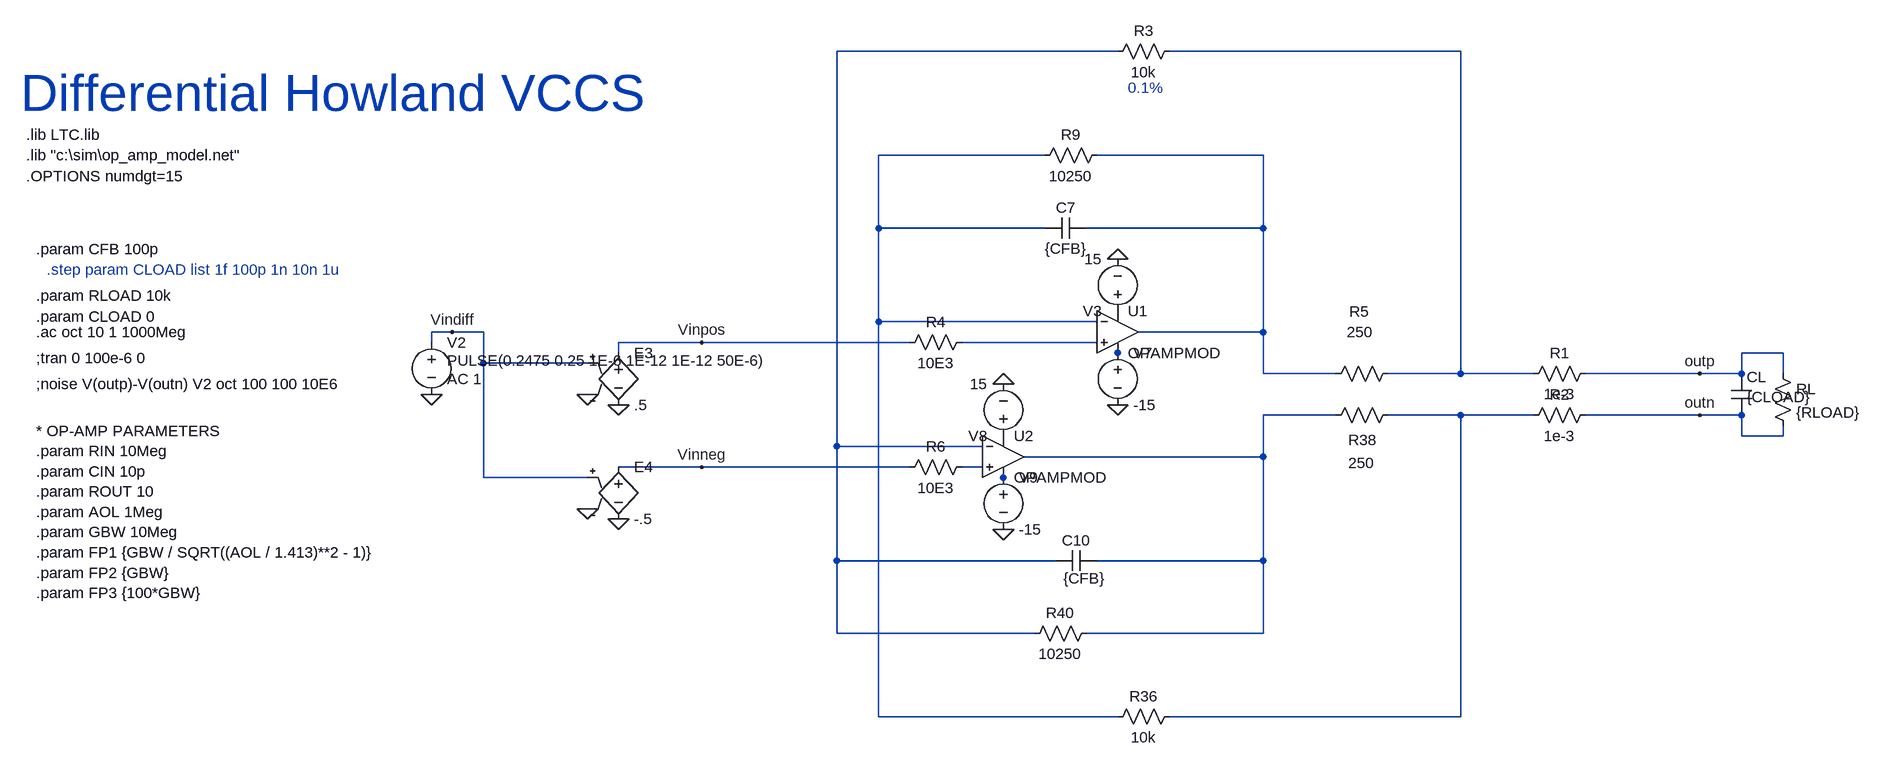
[diagram p0: schematic differential_howland.asc]
differential_howland.asc, the LTspice schematic file:
Version 4
SHEET 1 5476 1528
WIRE 3184 -704 2752 -704
WIRE 3712 -704 3264 -704
WIRE 3072 -544 2816 -544
WIRE 3408 -544 3152 -544
WIRE 2816 -432 2816 -544
WIRE 3072 -432 2816 -432
WIRE 3408 -432 3408 -544
WIRE 3408 -432 3136 -432
WIRE 2816 -288 2816 -432
WIRE 3152 -288 2816 -288
WIRE 2160 -272 2128 -272
WIRE 2208 -272 2160 -272
WIRE 3408 -272 3408 -432
WIRE 3408 -272 3216 -272
WIRE 2128 -256 2128 -272
WIRE 2544 -256 2416 -256
WIRE 2864 -256 2544 -256
WIRE 3152 -256 2944 -256
WIRE 2416 -240 2416 -256
WIRE 3184 -240 3184 -256
WIRE 4208 -240 4144 -240
WIRE 2208 -224 2208 -272
WIRE 2368 -224 2208 -224
WIRE 3408 -208 3408 -272
WIRE 3520 -208 3408 -208
WIRE 3712 -208 3712 -704
WIRE 3712 -208 3600 -208
WIRE 3824 -208 3712 -208
WIRE 4080 -208 3904 -208
WIRE 4144 -208 4144 -240
WIRE 4144 -208 4080 -208
WIRE 4208 -208 4208 -240
WIRE 3520 -144 3408 -144
WIRE 3712 -144 3600 -144
WIRE 3824 -144 3712 -144
WIRE 4080 -144 3904 -144
WIRE 4144 -144 4080 -144
WIRE 4144 -112 4144 -144
WIRE 4208 -112 4208 -128
WIRE 4208 -112 4144 -112
WIRE 2752 -96 2752 -704
WIRE 2976 -96 2752 -96
WIRE 3408 -80 3408 -144
WIRE 3408 -80 3040 -80
WIRE 2544 -64 2416 -64
WIRE 2864 -64 2544 -64
WIRE 2976 -64 2944 -64
WIRE 2208 -48 2208 -224
WIRE 2368 -48 2208 -48
WIRE 3008 -48 3008 -64
WIRE 2752 80 2752 -96
WIRE 3088 80 2752 80
WIRE 3408 80 3408 -80
WIRE 3408 80 3152 80
WIRE 2752 192 2752 80
WIRE 3056 192 2752 192
WIRE 3408 192 3408 80
WIRE 3408 192 3136 192
WIRE 2816 320 2816 -288
WIRE 3184 320 2816 320
WIRE 3712 320 3712 -144
WIRE 3712 320 3264 320
FLAG 3184 -384 0
FLAG 3184 -160 0
FLAG 3008 -192 0
FLAG 3008 32 0
FLAG 2128 -176 0
FLAG 2368 -176 0
FLAG 2368 0 0
FLAG 4080 -208 outp
FLAG 4080 -144 outn
FLAG 2544 -256 Vinpos
FLAG 2544 -64 Vinneg
FLAG 2160 -272 Vindiff
FLAG 2416 16 0
FLAG 2416 -160 0
SYMBOL res 3280 -720 R90
WINDOW 0 0 56 VBottom 2
WINDOW 3 32 56 VTop 2
SYMATTR InstName R3
SYMATTR Value 10k
SYMBOL res 3504 -192 R270
WINDOW 0 96 52 VTop 2
WINDOW 3 96 53 VBottom 2
SYMATTR InstName R5
SYMATTR Value 250
SYMBOL cap 3072 -416 R270
WINDOW 0 32 32 VTop 2
WINDOW 3 0 32 VBottom 2
SYMATTR InstName C7
SYMATTR Value {CFB}
SYMBOL res 4192 -224 R0
SYMATTR InstName RL
SYMATTR Value {RLOAD}
SYMBOL res 3168 -560 R90
WINDOW 0 0 56 VBottom 2
WINDOW 3 32 56 VTop 2
SYMATTR InstName R9
SYMATTR Value 10250
SYMBOL res 3280 304 R90
WINDOW 0 0 56 VBottom 2
WINDOW 3 32 56 VTop 2
SYMATTR InstName R36
SYMATTR Value 10k
SYMBOL res 3616 -160 R90
WINDOW 0 70 55 VBottom 2
WINDOW 3 74 57 VTop 2
SYMATTR InstName R38
SYMATTR Value 250
SYMBOL cap 3152 64 R90
WINDOW 0 0 32 VBottom 2
WINDOW 3 59 19 VBottom 2
SYMATTR InstName C10
SYMATTR Value {CFB}
SYMBOL res 3152 176 R90
WINDOW 0 0 56 VBottom 2
WINDOW 3 32 56 VTop 2
SYMATTR InstName R40
SYMATTR Value 10250
SYMBOL voltage 3184 -288 R180
WINDOW 123 0 0 Left 2
WINDOW 39 0 0 Left 2
SYMATTR InstName V3
SYMATTR Value 15
SYMBOL voltage 3184 -256 R0
WINDOW 123 0 0 Left 2
WINDOW 39 0 0 Left 2
SYMATTR InstName V7
SYMATTR Value -15
SYMBOL voltage 3008 -96 R180
WINDOW 123 0 0 Left 2
WINDOW 39 0 0 Left 2
SYMATTR InstName V8
SYMATTR Value 15
SYMBOL voltage 3008 -64 R0
WINDOW 123 0 0 Left 2
WINDOW 39 0 0 Left 2
SYMATTR InstName V9
SYMATTR Value -15
SYMBOL voltage 2128 -272 R0
WINDOW 3 24 44 Left 2
WINDOW 123 24 72 Left 2
WINDOW 39 0 0 Left 2
SYMATTR Value PULSE(0.2475 0.25 1E-6 1E-12 1E-12 50E-6)
SYMATTR Value2 AC 1
SYMATTR InstName V2
SYMBOL e 2416 -256 R0
SYMATTR InstName E3
SYMATTR Value .5
SYMBOL e 2416 -80 R0
SYMATTR InstName E4
SYMATTR Value -.5
SYMBOL cap 4128 -208 R0
WINDOW 3 24 36 Left 2
WINDOW 0 24 5 Left 2
SYMATTR Value {CLOAD}
SYMATTR InstName CL
SYMBOL Opamps\\opamp2 3184 -336 R0
SYMATTR InstName U1
SYMATTR Value OPAMPMOD
SYMATTR Value2 AV={AOL} RO={ROUT} RIN={RIN} CIN={CIN} FP1={FP1} FP2={FP2} FP3={FP3}
SYMBOL Opamps\\opamp2 3008 -144 R0
SYMATTR InstName U2
SYMATTR Value OPAMPMOD
SYMATTR Value2 AV={AOL} RO={ROUT} RIN={RIN} CIN={CIN} FP1={FP1} FP2={FP2} FP3={FP3}
SYMBOL res 3920 -224 R90
WINDOW 0 0 56 VBottom 2
WINDOW 3 32 56 VTop 2
SYMATTR InstName R1
SYMATTR Value 1e-3
SYMBOL res 3920 -160 R90
WINDOW 0 0 56 VBottom 2
WINDOW 3 32 56 VTop 2
SYMATTR InstName R2
SYMATTR Value 1e-3
SYMBOL res 2960 -272 R90
WINDOW 0 0 56 VBottom 2
WINDOW 3 32 56 VTop 2
SYMATTR InstName R4
SYMATTR Value 10E3
SYMBOL res 2960 -80 R90
WINDOW 0 0 56 VBottom 2
WINDOW 3 32 56 VTop 2
SYMATTR InstName R6
SYMATTR Value 10E3
TEXT 3200 -648 Left 2 ;0.1%
TEXT 1520 -272 Left 2 !.ac oct 10 1 1000Meg
TEXT 1520 -232 Left 2 !;tran 0 100e-6 0
TEXT 1504 -512 Left 2 !.OPTIONS numdgt=15
TEXT 1520 -192 Left 2 !;noise V(outp)-V(outn) V2 oct 100 100 10E6
TEXT 1504 -544 Left 2 !.lib "c:\\sim\\op_amp_model.net"
TEXT 1520 -400 Left 2 !.param CFB 100p
TEXT 1496 -640 Left 6 ;Differential Howland VCCS
TEXT 1520 -120 Left 2 !* OP-AMP PARAMETERS\n.param RIN 10Meg\n.param CIN 10p\n.param ROUT 10\n.param AOL 1Meg\n.param GBW 10Meg\n.param FP1 {GBW / SQRT((AOL / 1.413)**2 - 1)}\n.param FP2 {GBW}\n.param FP3 {100*GBW}
TEXT 1520 -328 Left 2 !.param RLOAD 10k
TEXT 1536 -368 Left 2 ;.step param CLOAD list 1f 100p 1n 10n 1u
TEXT 1520 -296 Left 2 !.param CLOAD 0
TEXT 1504 -576 Left 2 !.lib LTC.lib

The netlist it stands for:
* differential_howland.asc
R3 N002 N001 10k
R5 N004 N002 250
C7 N003 N004 {CFB}
RL outp outn {RLOAD}
R9 N004 N003 10250
R36 N008 N003 10k
R38 N008 N007 250
C10 N007 N001 {CFB}
R40 N007 N001 10250
V3 P001 0 15
V7 N006 0 -15
V8 P002 0 15
V9 N010 0 -15
V2 Vindiff 0 PULSE(0.2475 0.25 1E-6 1E-12 1E-12 50E-6) AC 1
E3 Vinpos 0 Vindiff 0 .5
E4 Vinneg 0 Vindiff 0 -.5
CL outp outn {CLOAD}
XU1 N005 N003 P001 N006 N004 OPAMPMOD AV={AOL} RO={ROUT} RIN={RIN} CIN={CIN} FP1={FP1} FP2={FP2} FP3={FP3}  ; pins In+ In- V+ V- OUT
XU2 N009 N001 P002 N010 N007 OPAMPMOD AV={AOL} RO={ROUT} RIN={RIN} CIN={CIN} FP1={FP1} FP2={FP2} FP3={FP3}  ; pins In+ In- V+ V- OUT
R1 outp N002 1e-3
R2 outn N008 1e-3
R4 N005 Vinpos 10E3
R6 N009 Vinneg 10E3
* 0.1%
.ac oct 10 1 1000Meg
;tran 0 100e-6 0
.OPTIONS numdgt=15
;noise V(outp)-V(outn) V2 oct 100 100 10E6
.lib "c:\sim\op_amp_model.net"
.param CFB 100p
* Differential Howland VCCS
* OP-AMP PARAMETERS
.param RIN 10Meg
.param CIN 10p
.param ROUT 10
.param AOL 1Meg
.param GBW 10Meg
.param FP1 {GBW / SQRT((AOL / 1.413)**2 - 1)}
.param FP2 {GBW}
.param FP3 {100*GBW}
.param RLOAD 10k
* .step param CLOAD list 1f 100p 1n 10n 1u
.param CLOAD 0
.lib LTC.lib
.backanno
.end